# EasyEDA schematic SCH_Electronic-Harp_2026-05-11.json
TITLE: Sheet_1; REV: 1.0; Date: 2026-05-11; Sheet: 1/1; Drawn By: pazb; Company: Your Company
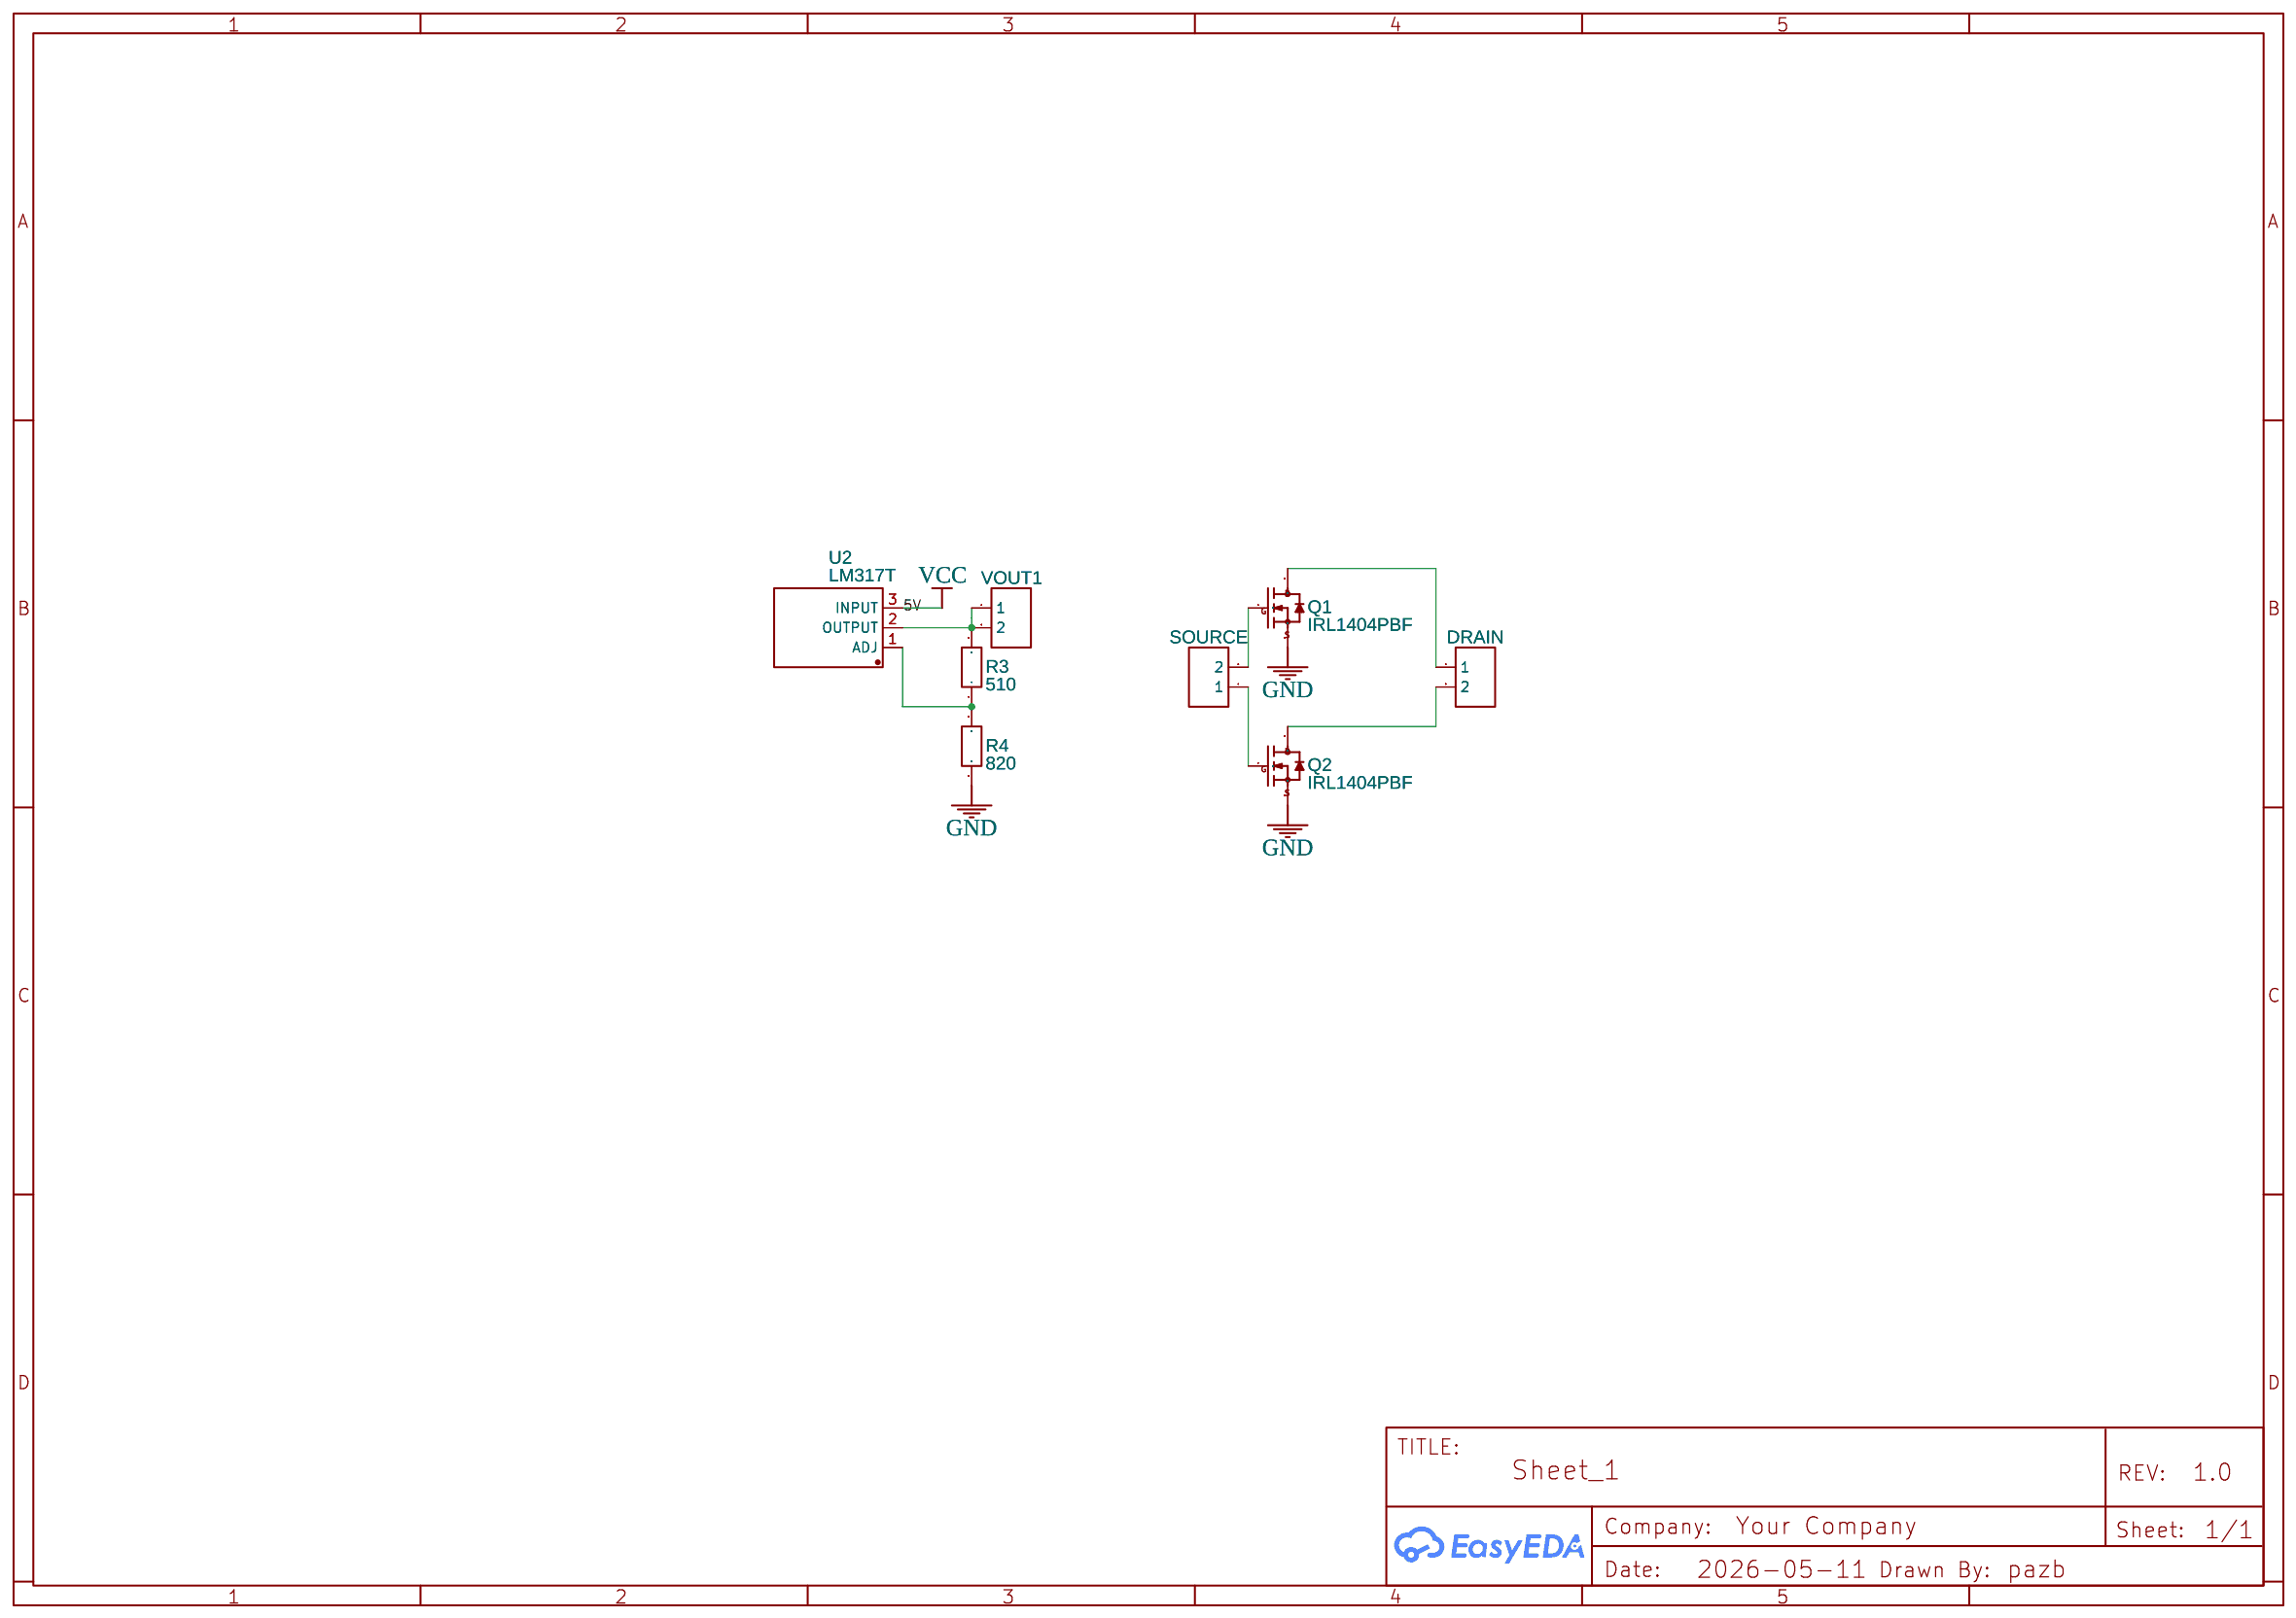
[diagram p0: schematic sheet]

## Parts
DRAIN  HDR-F-2.54_1x2  [HDR-F-2.54_1X2]
Q1  IRL1404PBF  [TO-220-3_L10.0-W4.5-P2.54-L]
Q2  IRL1404PBF  [TO-220-3_L10.0-W4.5-P2.54-L]
R3  510  [R0603]
R4  820  [R0603]
SOURCE  HDR-F-2.54_1x2  [HDR-F-2.54_1X2]
U2  LM317T  [TO-220AB-3_L10.4-W4.6-P2.54-T]
VOUT1  HDR-F-2.54_1x2  [HDR-F-2.54_1X2]

## Library data of the parts
DRAIN SOURCE VOUT1 = HDR-F-2.54_1x2: Supplier Part: C49661; Supplier: LCSC; Contributor: LCEDA_Lib
Q1 Q2 = IRL1404PBF: Contributor: LCSC; Supplier: LCSC; Manufacturer: Infineon(英飞凌); Supplier Part: C148270; JLCPCB Part Class: Extended Part
R3 R4 = R_0603_EU: Contributor: LCEDA_Lib
U2 = LM317T: Contributor: LCSC; Supplier: LCSC; Supplier Part: C361026; Manufacturer: ST(意法半导体); JLCPCB Part Class: Extended Part

## Nets
5V: U2.3(INPUT)
GND: Q1.3(S) Q2.3(S) R4.1
Net-(DRAIN-1): DRAIN.1 Q1.2(D)
Net-(DRAIN-2): DRAIN.2 Q2.2(D)
Net-(Q1-1): Q1.1(G) SOURCE.2
Net-(Q2-1): Q2.1(G) SOURCE.1
Net-(R3-1): R3.1 R4.2 U2.1(ADJ)
Net-(R3-2): R3.2 U2.2(OUTPUT) VOUT1.1 VOUT1.2
